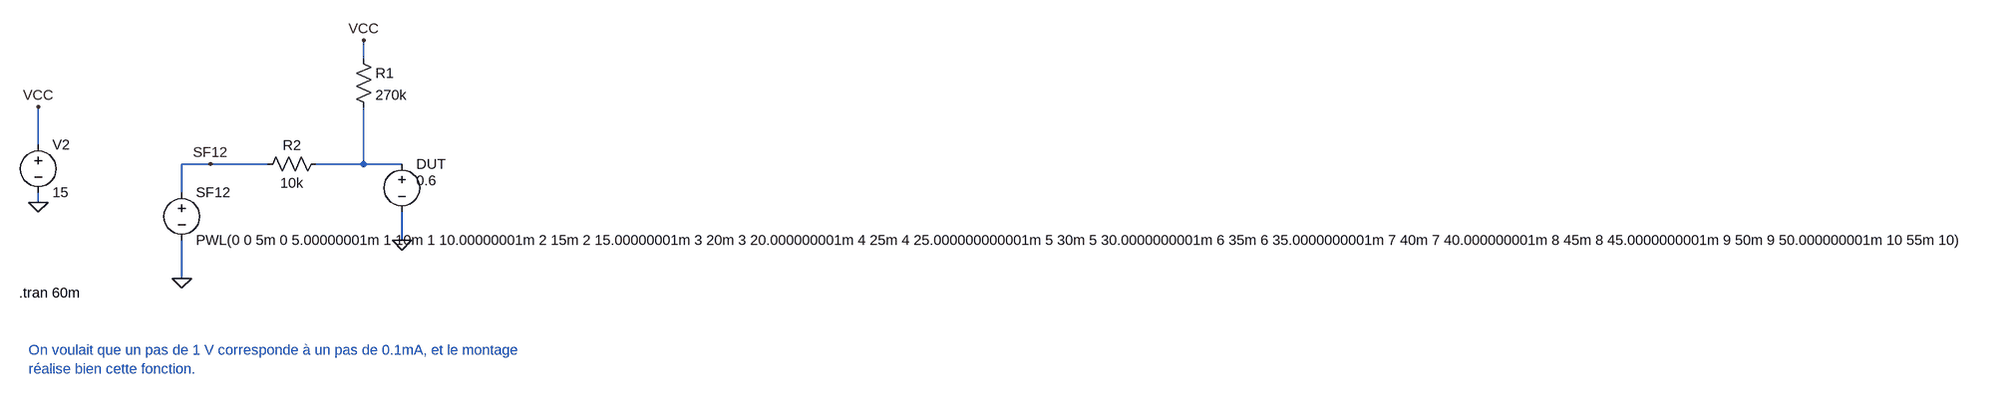
[diagram p0: schematic ADAPTATION IB.asc]
ADAPTATION IB.asc, the LTspice schematic file:
Version 4
SHEET 1 3340 680
WIRE 288 -32 288 -64
WIRE -256 112 -256 48
WIRE 32 144 -16 144
WIRE 128 144 32 144
WIRE 288 144 288 48
WIRE 288 144 208 144
WIRE 352 144 288 144
WIRE -16 192 -16 144
WIRE -256 208 -256 192
WIRE 352 272 352 224
WIRE -16 336 -16 272
FLAG -256 208 0
FLAG -256 48 VCC
FLAG -16 336 0
FLAG 288 -64 VCC
FLAG 352 272 0
FLAG 32 144 SF12
SYMBOL res 112 160 R270
WINDOW 0 32 56 VTop 2
WINDOW 3 0 56 VBottom 2
SYMATTR InstName R2
SYMATTR Value 10k
SYMBOL res 272 -48 R0
SYMATTR InstName R1
SYMATTR Value 270k
SYMBOL voltage -16 176 R0
WINDOW 123 0 0 Left 2
WINDOW 39 0 0 Left 2
SYMATTR InstName SF12
SYMATTR Value PWL(0 0 5m 0 5.00000001m 1 10m 1 10.00000001m 2 15m 2 15.00000001m 3 20m 3 20.000000001m 4 25m 4 25.000000000001m 5 30m 5 30.0000000001m 6 35m 6 35.0000000001m 7 40m 7 40.000000001m 8 45m 8 45.0000000001m 9 50m 9 50.000000001m 10 55m 10)
SYMBOL voltage -256 96 R0
WINDOW 123 0 0 Left 2
WINDOW 39 0 0 Left 2
SYMATTR InstName V2
SYMATTR Value 15
SYMBOL voltage 352 128 R0
WINDOW 3 24 44 Left 2
WINDOW 123 0 0 Left 2
WINDOW 39 0 0 Left 2
SYMATTR Value 0.6
SYMATTR InstName DUT
TEXT -288 360 Left 2 !.tran 60m
TEXT -272 456 Left 2 ;On voulait que un pas de 1 V corresponde à un pas de 0.1mA, et le montage\nréalise bien cette fonction.

The netlist it stands for:
* ADAPTATION IB.asc
R2 SF12 N001 10k
R1 VCC N001 270k
V§SF12 SF12 0 PWL(0 0 5m 0 5.00000001m 1 10m 1 10.00000001m 2 15m 2 15.00000001m 3 20m 3 20.000000001m 4 25m 4 25.000000000001m 5 30m 5 30.0000000001m 6 35m 6 35.0000000001m 7 40m 7 40.000000001m 8 45m 8 45.0000000001m 9 50m 9 50.000000001m 10 55m 10)
V2 VCC 0 15
V§DUT N001 0 0.6
.tran 60m
* On voulait que un pas de 1 V corresponde à un pas de 0.1mA, et le montage
* réalise bien cette fonction.
.backanno
.end

* Results of the author's LTspice run, read from the files saved beside the schematic
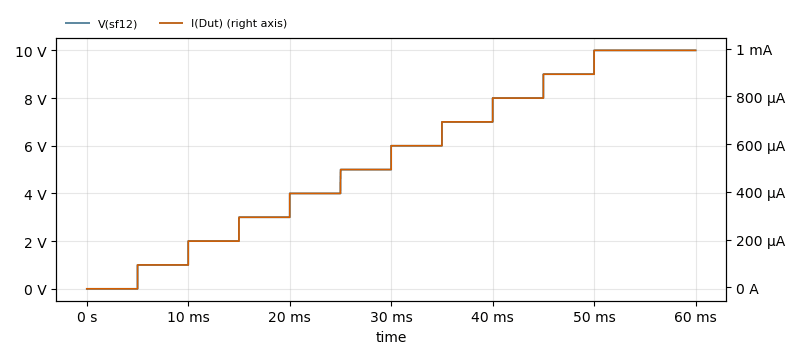
[diagram p1: Transient Analysis of ADAPTATION IB.asc, plotted from the saved traces]
* Transient Analysis, 1 run:
*   V(sf12): min 0 V, max 10 V, average 5.417 V, rms 6.357 V, last 10 V
*   I(Dut): min -6.667 µA, max 993.3 µA, average 535 µA, rms 630.1 µA, last 993.3 µA